# EAGLE design Versie 4 (EAGLE 7.3.0)

## Sheet 1 of 2
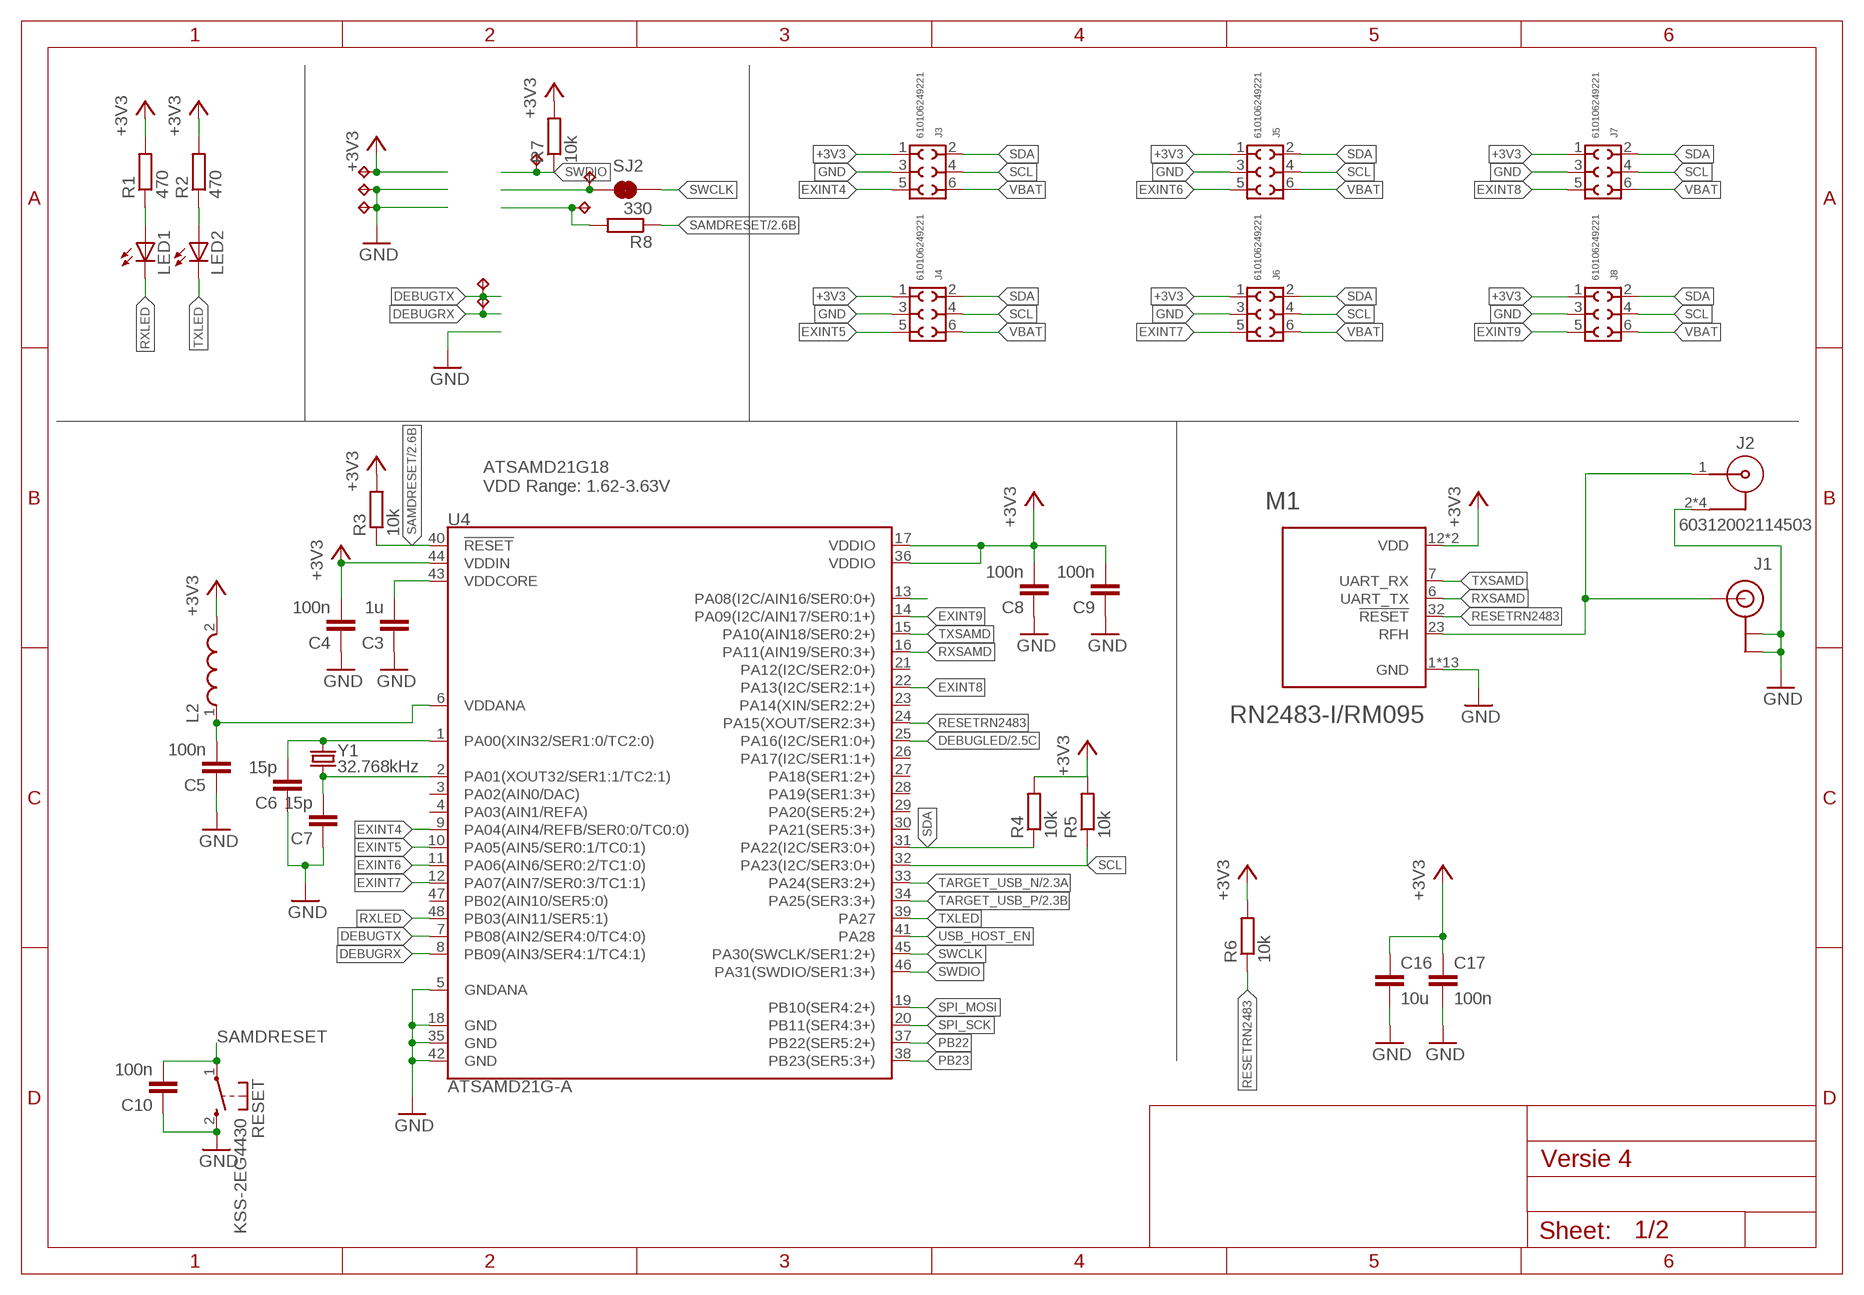
[diagram p0: schematic, sheet 1]

### Parts
C3  1u  C-EUC0603  [C0603]
C4  100n  C-EUC0603  [C0603]
C5  100n  C-EUC0603  [C0603]
C6  15p  C-EUC0603  [C0603]
C7  15p  C-EUC0603  [C0603]
C8  100n  C-EUC0603  [C0603]
C9  100n  C-EUC0603  [C0603]
C10  100n  C-EUC0603  [C0603]
C16  10u  C-EUC0805  [C0805]
C17  100n  C-EUC0603  [C0603]
J1  U.FL  [U.FL]
J2  60312002114503  [60312002114503]
J3  610106249221  6101XX249221_610106249221  [610106249221]
J4  610106249221  6101XX249221_610106249221  [610106249221]
J5  610106249221  6101XX249221_610106249221  [610106249221]
J6  610106249221  6101XX249221_610106249221  [610106249221]
J7  610106249221  6101XX249221_610106249221  [610106249221]
J8  610106249221  6101XX249221_610106249221  [610106249221]
L2  WE-CBA_0603(WB/HS)  [WE-CBA_0603(W=2.2)]
LED1  LEDCHIP-LED0603  [CHIP-LED0603]
LED2  LEDCHIP-LED0603  [CHIP-LED0603]
M1  RN2483-I/RM095  [MICROCHIP_RN2483-I/RM095]
R1  470  R-EU_R0603  [R0603]
R2  470  R-EU_R0603  [R0603]
R3  10k  R-EU_R0603  [R0603]
R4  10k  R-EU_R0603  [R0603]
R5  10k  R-EU_R0603  [R0603]
R6  10k  R-EU_R0603  [R0603]
R7  10k  R-EU_R0603  [R0603]
R8  330  R-EU_R0603  [R0603]
RESET  KSS-2EG4430  [KSS-2EG4430]
SJ2  JUMPER-PAD-2-NC_BY_TRACENO_SILK  [PAD-JUMPER-2-NC_BY_TRACE_NO_SILK]
TP1  TPB1,27  [B1,27]
TP2  TPB1,27  [B1,27]
TP3  TPB1,27  [B1,27]
TP4  TPB1,27  [B1,27]
TP5  TPB1,27  [B1,27]
TP6  TPB1,27  [B1,27]
TP7  TPB1,27  [B1,27]
TP8  TPB1,27  [B1,27]
U4  ATSAMD21G-A  [TQFP-48]
Y1  32.768kHz  CRYSTAL3.2X1.5MM  [CRYSTAL-SMD-3.2X1.5MM]

### Nets
+3V3: C4.2 C8.2 C9.2 C16.1 C17.1 J3.1 J4.1 J5.1 J6.1 J7.1 J8.1 L2.2 M1.12(VDD) M1.34(VDD) R1.2 R2.2 R3.2 R4.2 R5.2 R6.2 R7.2 TP1.TP U4.17(VDDIO) U4.36(VDDIO) U4.44(VDDIN) ; also sheet 2
BUTTON: U4.13(PA08(I2C/AIN16/SER0:0+)) ; also sheet 2
DEBUGLED: U4.25(PA16(I2C/SER1:0+)) ; also sheet 2
DEBUGRX: TP8.TP U4.8(PB09(AIN3/SER4:1/TC4:1))
DEBUGTX: TP7.TP U4.7(PB08(AIN2/SER4:0/TC4:0))
EXINT4: J3.5 U4.9(PA04(AIN4/REFB/SER0:0/TC0:0))
EXINT5: J4.5 U4.10(PA05(AIN5/SER0:1/TC0:1))
EXINT6: J5.5 U4.11(PA06(AIN6/SER0:2/TC1:0))
EXINT7: J6.5 U4.12(PA07(AIN7/SER0:3/TC1:1))
EXINT8: J7.5 U4.22(PA13(I2C/SER2:1+))
EXINT9: J8.5 U4.14(PA09(I2C/AIN17/SER0:1+))
GND: C3.1 C4.1 C5.1 C6.1 C7.1 C8.1 C9.1 C10.1 C16.2 C17.2 J1.P$1(GND) J1.P$2(GND) J2.2 J2.3 J2.4 J2.5 J3.3 J4.3 J5.3 J6.3 J7.3 J8.3 M1.1(GND) M1.8(GND) M1.11(GND) M1.20(GND) M1.21(GND) M1.22(GND) M1.24(GND) M1.26(GND) M1.27(GND) M1.28(GND) M1.33(GND) M1.41(GND) M1.47(GND) RESET.2(S) TP2.TP TP3.TP U4.5(GNDANA) U4.18(GND) U4.35(GND) U4.42(GND) ; also sheet 2
N$1: LED1.A R1.1
N$2: LED2.A R2.1
N$3: SJ2.2 TP5.TP
N$5: C6.2 U4.1(PA00(XIN32/SER1:0/TC2:0)) Y1.P$2
N$6: C7.2 U4.2(PA01(XOUT32/SER1:1/TC2:1)) Y1.P$1
N$7: C5.2 L2.1 U4.6(VDDANA)
N$10: J1.P$3(SIGNAL) J2.1 M1.23(RFH)
N$15: R8.2 TP6.TP
PB22: U4.37(PB22(SER5:2+))
PB23: U4.38(PB23(SER5:3+))
RESETRN2483: M1.32(!RESET) R6.1 U4.24(PA15(XOUT/SER2:3+))
RXLED: LED1.C U4.48(PB03(AIN11/SER5:1))
RXSAMD: M1.6(UART_TX) U4.16(PA11(AIN19/SER0:3+))
SAMDRESET: C10.2 R3.1 R8.1 RESET.1(P) U4.40(!RESET!) ; also sheet 2
SCL: J3.4 J4.4 J5.4 J6.4 J7.4 J8.4 R5.1 U4.32(PA23(I2C/SER3:0+))
SDA: J3.2 J4.2 J5.2 J6.2 J7.2 J8.2 R4.1 U4.31(PA22(I2C/SER3:0+))
SPI_MOSI: U4.19(PB10(SER4:2+))
SPI_SCK: U4.20(PB11(SER4:3+))
SWCLK: SJ2.1 U4.45(PA30(SWCLK/SER1:2+))
SWDIO: R7.1 TP4.TP U4.46(PA31(SWDIO/SER1:3+))
TARGET_USB_N: U4.33(PA24(SER3:2+)) ; also sheet 2
TARGET_USB_P: U4.34(PA25(SER3:3+)) ; also sheet 2
TXLED: LED2.C U4.39(PA27)
TXSAMD: M1.7(UART_RX) U4.15(PA10(AIN18/SER0:2+))
USB_HOST_EN: U4.41(PA28)
VBAT: J3.6 J4.6 J5.6 J6.6 J7.6 J8.6 ; also sheet 2
VDDCORE: C3.2 U4.43(VDDCORE)
Unconnected: U4.3(PA02(AIN0/DAC)) U4.4(PA03(AIN1/REFA)) U4.21(PA12(I2C/SER2:0+)) U4.23(PA14(XIN/SER2:2+)) U4.26(PA17(I2C/SER1:1+)) U4.27(PA18(SER1:2+)) U4.28(PA19(SER1:3+)) U4.29(PA20(SER5:2+)) U4.30(PA21(SER5:3+)) U4.47(PB02(AIN10/SER5:0))

### Notes on the sheet
- ATSAMD21G18
  VDD Range: 1.62-3.63V

## Sheet 2 of 2
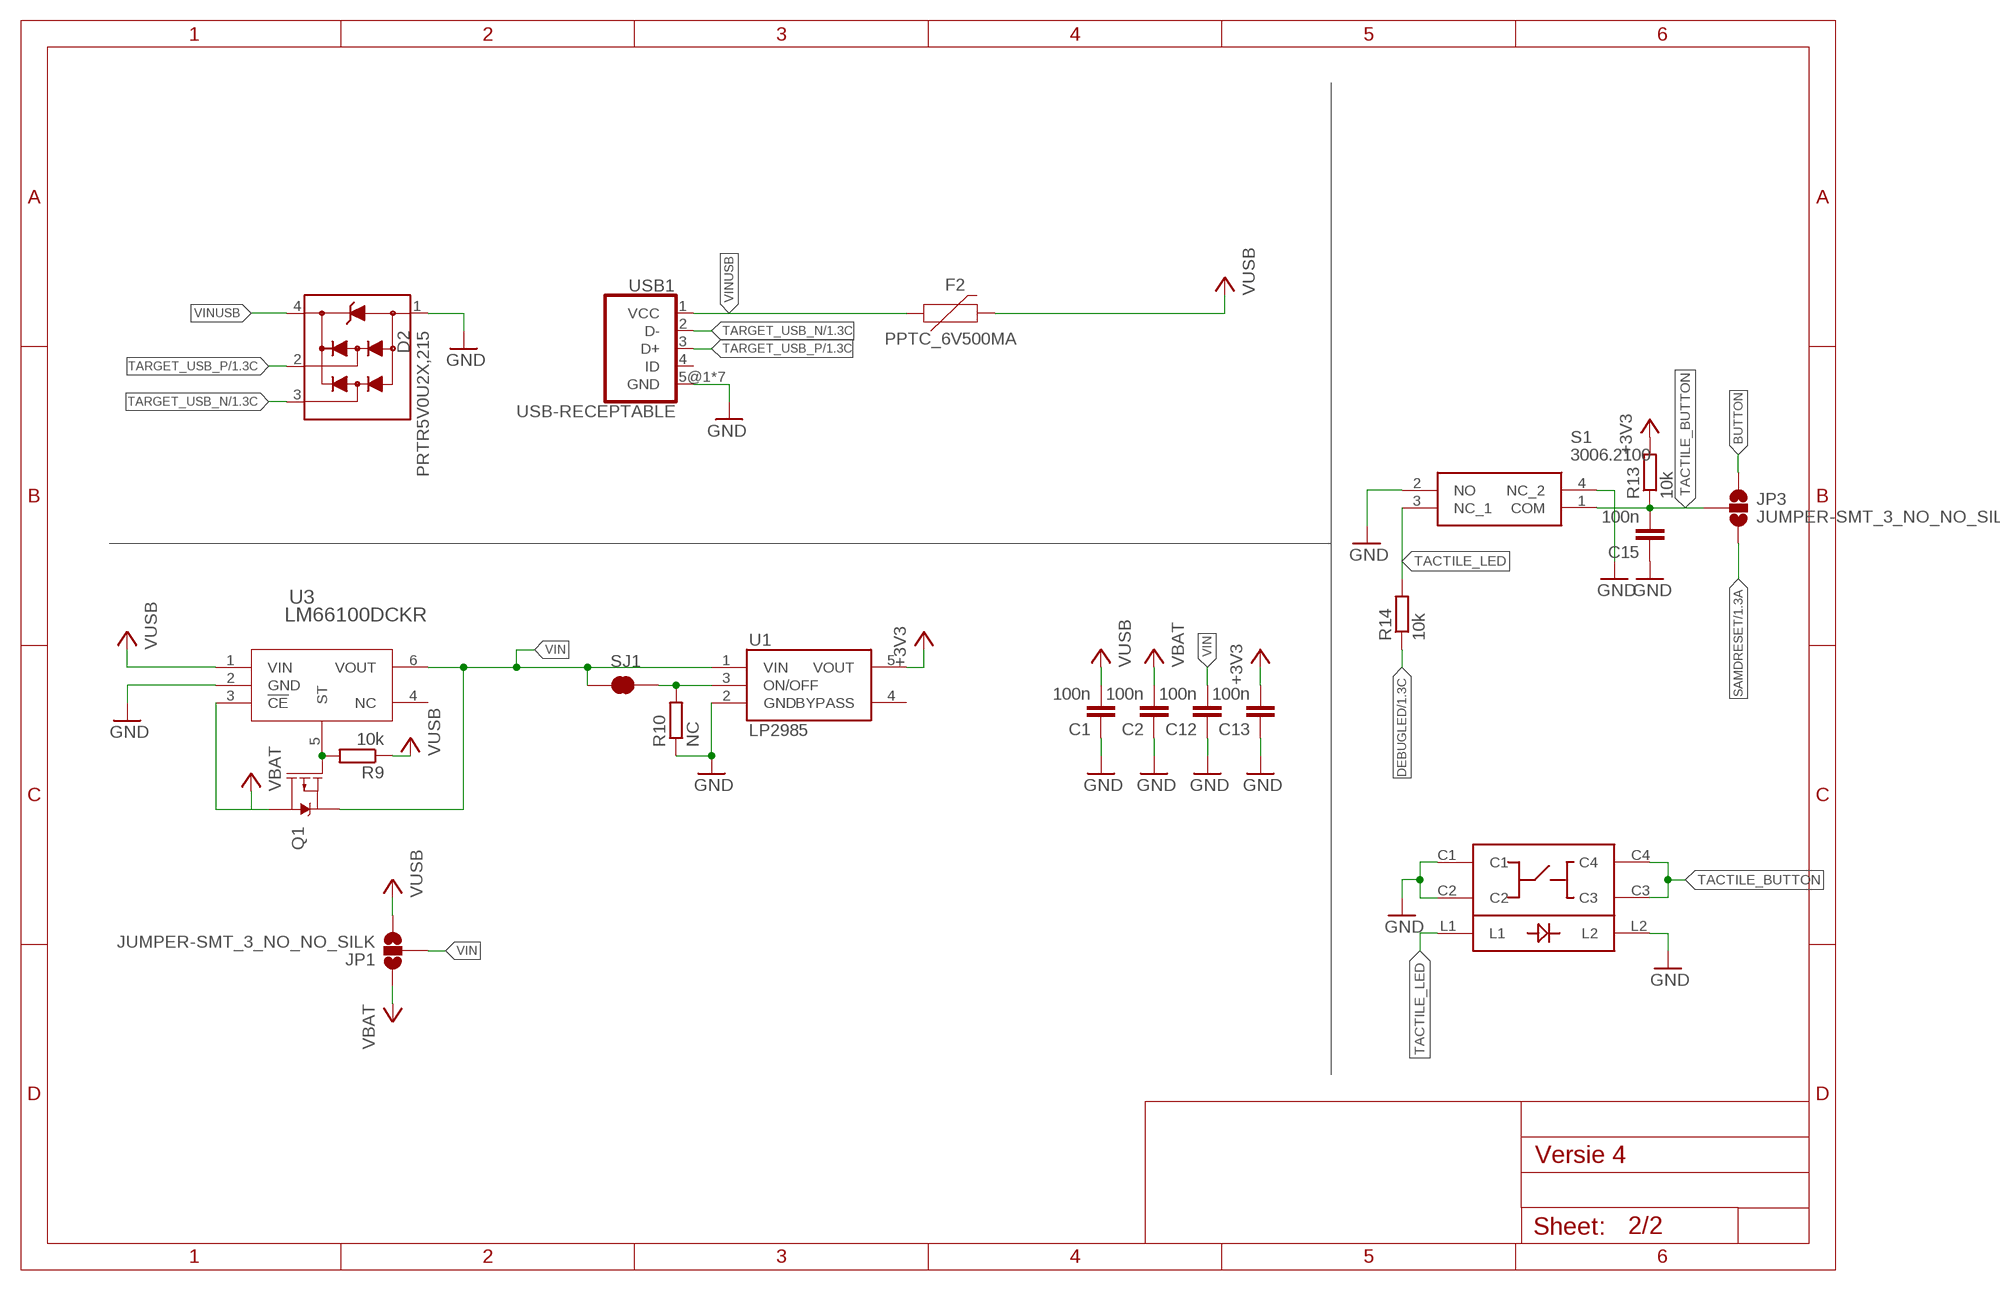
[diagram p1: schematic, sheet 2]

### Parts
C1  100n  C-EUC0603  [C0603]
C2  100n  C-EUC0603  [C0603]
C12  100n  C-EUC0603  [C0603]
C13  100n  C-EUC0603  [C0603]
C15  100n  C-EUC0603  [C0603]
D2  PRTR5V0U2X,215  [SOT143B]
F2  PPTC_6V500MA  [0805]
JP1  JUMPER-SMT_3_NO_NO_SILK  [SMT-JUMPER_3_0-NO_TRACE_NO-SILK]
JP3  JUMPER-SMT_3_NO_NO_SILK  [SMT-JUMPER_3_0-NO_TRACE_NO-SILK]
Q1  MOSFET_PCH-DMG2307L  [SOT23-3]
R9  10k  R-EU_R0603  [R0603]
R10  NC  R-EU_R0603  [R0603]
R13  10k  R-EU_R0603  [R0603]
R14  10k  R-EU_R0603  [R0603]
S1  3006.2100  [30062101]
SJ1  JUMPER-PAD-2-NC_BY_TRACENO_SILK  [PAD-JUMPER-2-NC_BY_TRACE_NO_SILK]
U1  LP2985AIM5-3.3  [SOT25]
U3  LM66100DCKR  [DCK6_TEX]
U$1  LS1201  [LS1201]
USB1  USB-RECEPTABLE  [FCI-10103594-0001LF]

### Nets
+3V3: C13.2 R13.2 U1.5(VOUT) ; also sheet 1
BUTTON: JP3.1 ; also sheet 1
DEBUGLED: R14.1 ; also sheet 1
GND: C1.1 C2.1 C12.1 C13.1 C15.1 D2.1 R10.1 S1.2(NO) S1.4(NC_2) U1.2(GND) U3.2(GND) U$1.C1 U$1.C2 U$1.L2 USB1.5@1(GND) USB1.5@2(GND) USB1.5@3(GND) USB1.5@4(GND) USB1.5@5(GND) USB1.5@6(GND) USB1.5@7(GND) ; also sheet 1
N$14: Q1.1(G) R9.2 U3.5(ST)
ONOFF: R10.2 SJ1.1 U1.3(ON/OFF)
SAMDRESET: JP3.3 ; also sheet 1
TACTILE_BUTTON: C15.2 JP3.2 R13.1 S1.1(COM) U$1.C3 U$1.C4
TACTILE_LED: R14.2 S1.3(NC_1) U$1.L1
TARGET_USB_N: D2.3 USB1.2(D-) ; also sheet 1
TARGET_USB_P: D2.2 USB1.3(D+) ; also sheet 1
VBAT: C2.2 JP1.1 Q1.3(D) U3.3(!CE) ; also sheet 1
VIN: C12.2 JP1.2 Q1.2(S) SJ1.2 U1.1(VIN) U3.6(VOUT)
VINUSB: D2.4 F2.1 USB1.1(VCC)
VUSB: C1.2 F2.2 JP1.3 R9.1 U3.1(VIN)
Unconnected: U1.4(BYPASS) U3.4(NC) USB1.4(ID)

## Library data of the parts
C1-C10 C12 C13 C15-C17 = rcl:C-EU: CAPACITOR, European symbol
D2 = PRTR5V0U2X_215:PRTR5V0U2X,215: Ultra low capacitance double rail-to-rail ESD protection diode Check prices <https://pricing.snapeda.com/parts/PRTR5V0U2X%2C215/Nexperia%20USA%20Inc./view-part?ref=eda>; AVAILABILITY: Good; DESCRIPTION: Clamp Ipp Tvs Diode Surface Mount SOT-143B; MF: Nexperia USA Inc.; MP: PRTR5V0U2X,215; PACKAGE: None; PRICE: None; PURCHASE-URL: https://pricing.snapeda.com/search/part/PRTR5V0U2X,215/?ref=eda
F2 = SparkFun-Fuses:PPTC: Resettable Fuse PPTC Resettable Fuse. Really a sort of resistor with a polymeric positive temperature coefficient whose resistance increases dramatically with an increase in temperature. When heated by the power passing through the resistance rises causing the current to be limited, protecting the circuit. This is achieved by the transition of the polymer from a crystalline to an amorphous state where the conductive carbon separates breaking the conductive pathways found in the cool crystalline structure. When a PPTC cools back down it resumes conducting letting the circuit turn back on. SparkFun Products: SparkFun RedBoard - Programmed with Arduino <https://www.sparkfun.com/products/12757> Pro Micro - 5V/16MHz <https://www.sparkfun.com/products/12640> Arduino Pro 328 - 5V/16MHz <https://www.sparkfun.com/products/10915> MP3 Trigger <https://www.sparkfun.com/products/13720>
J1 = SparkFun-Connectors:U.FL: SMD antenna connector- WRL-09144; PROD_ID: CONN-09193
J2 = Eagle_WR-SMA (rev21a):60312002114503: WR-SMA PCB THT Jack Straight MATERIAL PROPERTIES Insulator Material PTFE Insulator Color White Center Contact Material Beryllium Copper Center Contact Plating Gold, min. 0.76µm over Nickel Body Material Brass Body Plating Gold, min. 0.076µm over Nickel KIND PROPERTIES Interface MIL-STD-348 Connector Type SMA Gender Jack Orientation Type Straight GENERAL INFORMATION Operating Temperature -65 °C up to +165 °C Compliance RoHS ELECTRICAL PROPERTIES: Frequency Range DC~18 GHz MECHANICAL PROPERTIES: Mating Cycle 500 Cycles PACKAGING PROPERTIES Packaging Tray <https://katalog.we-online.com/media/images/v2/o122837v209%20WR-SMA_60312002114503.jpg> Details see: https://katalog.we-online.com/en/em/WR-SMA_THT_60312002114503 Updated by Ella Wu 2019-11-04 2019(C) Würth Elektronik; DATASHEET-URL: https://www.we-online.com/catalog/datasheet/60312002114503.pdf; GENDER: Jack; INTERFACE: MIL-STD-348; MOUNT: THT; ORIENTATION-TYPE: Straight; PART-NUMBER: 60312002114503; Z: 50Ohm
J3-J8 = WR-PHD_Rev21a:6101XX249221_610106249221: WR-PHD 2.54 mm PCB Socket Header - SMT Type - Double Row - Right Angle ARTICLE PROPERTIES: Pins:6;​ 8;​ 10;​ 12;​ 14;​ 16;​ 20;​ 22;​ 24;​ 26 KIND PROPERTIES: Pitch：2.54 mm Quality Class:3 as per CECC 75 301-802 Rows：Dual Gender：Socket Header Type：Angled MATERIAL PROPERTIES: Insulator Material :PA6T Insulator Flammability Rating:UL94 V-0 Contact Material:Copper Alloy Contact Plating:Gold Contact Type:Stamped GENERAL INFORMATION Operating Temperature:-40 up to +105 °C Compliance:Lead free / RoHS ELECTRICAL PROPERTIES: Rated Current:3 A IR 1:3 A Withstanding Voltage:600 V (AC) Contact Resistance:20 mΩ RISO:1000 MΩ CERTIFICATION UL Approval:E323964 PACKAGING PROPERTIES Packaging:Tape and Reel <https://katalog.we-online.com/media/images/v2/o33204v209%20Family_WR-PHD_6101_xx249221.jpg> Details see: https://katalog.we-online.com/en/em/PHD_2_54_SMT_DOUBLE_ROW_RIGHT_ANGLE_PCB_SOCKET_HEADER_6101XX249221 Updated by Yingchun,Shan 2019-10-24 2019 (C) Würth Elektronik; DATASHEET-URL: https://www.we-online.com/catalog/datasheet/610106249221.pdf; GENDER: Socket Header; IR: 3A; MOUNT: SMT; PACKAGING: Tape and Reel; PART-NUMBER: 610106249221; PINS: 6; PITCH: 2.54mm; ROWS: Dual; TYPE: Angled
JP1 JP3 = SparkFun-Jumpers:JUMPER-SMT_3_NO: Normally open jumper This jumper has three pads in close proximity to each other. Apply solder to close the connection(s).
L2 = EagleLibrary_Wuerth_Elektronik_eiSos_rev16a:WE-CBA: WE-CBA SMD EMI Suppression Ferrite Bead Characteristics Reliable Ni-Sn electrodes High rated current up to 5A Recommended soldering: Reflow Operating temperature: -55°C to +125°C Applications * Perfect as data line filter and for uncoupling of distribution voltage *This special SMD chip bead ferrites can be put directly on the printed circuit board. They offer excellent anti-EMI properties and low DC-resistance. Placed very close next to the interference source even with smallest size 0402,maximal impedance at 1000 Ω can be reached. *High Speed: "High Speed " SMD ferrites WE-CBF have lower impedance in the lower frequency ranges thus they have only a low attenuation for fast signals. Application e.g. USB 2.0, IEEE 1394,LVDS *Wide Band: "Wide Band" SMD ferrites WE-CBF already show high impedance in low frequency range. Therefore they are wide band through the whole spectrum. Application e.g. control signats, RS232, RS422, DC/DC converter *High Current: "High Current " SMD ferrites WE-CBF are designed for high current (over 1 A). The rated current refers to 40K self-heating. High current SMD ferrites are available in all there types (High Speed, Wide Band and High Frequency). Application e.g. power supply, DC/DC converter *Advice: Pay attention for the use of SMD-Ferrites for high current>1A and ambient temperature over +85°C that the rated current has to be reduced when temperature is above +85°C (Derating). *At+100°C environment temperature the maximal rated current has to add up to only 60% of the data sheet value ,without an overload of the component. Variant abbreviation WB means WIDE BAND HS means HIGH SPEED HC means HIGH CURRENT <http://katalog.we-online.de/media/images/eisos/FeCBA_pf2.jpg> Details see: http://katalog.we-online.de/en/pbs/WE-CBA/ Created: 2015-02-02 2015 (C) Wurth Elektronik
LED1 LED2 = led:LED: LED OSRAM: - CHIPLED LG R971, LG N971, LY N971, LG Q971, LY Q971, LO R971, LY R971 LH N974, LH R974 LS Q976, LO Q976, LY Q976 LO Q996 - Hyper CHIPLED LW Q18S LB Q993, LB Q99A, LB R99A - SideLED LS A670, LO A670, LY A670, LG A670, LP A670 LB A673, LV A673, LT A673, LW A673 LH A674 LY A675 LS A676, LA A676, LO A676, LY A676, LW A676 LS A679, LY A679, LG A679 - Hyper Micro SIDELED® LS Y876, LA Y876, LO Y876, LY Y876 LT Y87S - SmartLED LW L88C, LW L88S LB L89C, LB L89S, LG L890 LS L89K, LO L89K, LY L89K LS L896, LA L896, LO L896, LY L896 - TOPLED LS T670, LO T670, LY T670, LG T670, LP T670 LSG T670, LSP T670, LSY T670, LOP T670, LYG T670 LG T671, LOG T671, LSG T671 LB T673, LV T673, LT T673, LW T673 LH T674 LS T676, LA T676, LO T676, LY T676, LB T676, LH T676, LSB T676, LW T676 LB T67C, LV T67C, LT T67C, LS T67K, LO T67K, LY T67K, LW E67C LS E67B, LA E67B, LO E67B, LY E67B, LB E67C, LV E67C, LT E67C LW T67C LS T679, LY T679, LG T679 LS T770, LO T770, LY T770, LG T770, LP T770 LB T773, LV T773, LT T773, LW T773 LH T774 LS E675, LA E675, LY E675, LS T675 LS T776, LA T776, LO T776, LY T776, LB T776 LHGB T686 LT T68C, LB T68C - Hyper Mini TOPLED® LB M676 - Mini TOPLED Santana® LG M470 LS M47K, LO M47K, LY M47K Source: http://www.osram.convergy.de LUXEON: - LUMILED® LXK2-PW12-R00, LXK2-PW12-S00, LXK2-PW14-U00, LXK2-PW14-V00 LXK2-PM12-R00, LXK2-PM12-S00, LXK2-PM14-U00 LXK2-PE12-Q00, LXK2-PE12-R00, LXK2-PE12-S00, LXK2-PE14-T00, LXK2-PE14-U00 LXK2-PB12-K00, LXK2-PB12-L00, LXK2-PB12-M00, LXK2-PB14-N00, LXK2-PB14-P00, LXK2-PB14-Q00 LXK2-PR12-L00, LXK2-PR12-M00, LXK2-PR14-Q00, LXK2-PR14-R00 LXK2-PD12-Q00, LXK2-PD12-R00, LXK2-PD12-S00 LXK2-PH12-R00, LXK2-PH12-S00 LXK2-PL12-P00, LXK2-PL12-Q00, LXK2-PL12-R00 Source: www.luxeon.com KINGBRIGHT: KA-3528ASYC Source: www.kingbright.com
M1 = RN2483-I_RM095:RN2483-I/RM095: Sub-GHz Dual Band Long Range Transceiver LoRa Module Check prices <https://pricing.snapeda.com/parts/RN2483-I/RM095/Microchip%20Technology/view-part?ref=eda>; AVAILABILITY: Not in stock; DESCRIPTION: Sub-GHz Modules Dual Band Long Range LoRa Module; MF: Microchip Technology; MP: RN2483-I/RM095; PACKAGE: None; PRICE: None
Q1 = SparkFun-DiscreteSemi:MOSFET_PCH: P-channel MOSFETs Voltage controlled devices that allow control of high current outputs. SparkFun Products: SparkFun ESP32 Thing <https://www.sparkfun.com/products/13907> SparkFun ESP8266 Thing <https://www.sparkfun.com/products/13231>; PROD_ID: TRANS-11308; VALUE: 2.5A/30V/105mΩ
R1-R10 R13 R14 = rcl:R-EU_: RESISTOR, European symbol
RESET = buttons:KSS-2EG4430: Size: 3x6mm Height: 5mm from PCB Rating: DC12v 50mA Travel: 0.25±0.10mm Operating Force: 180±50gf Return Force: 60gf min Contact resistance: 100m? max Insulation resistance: 100M? min Operating life?50,000 cycles
S1 = SamacSys_Parts:3006.2100: Tactile Switches TACTILE Source: Datasheet <http://www.mouser.cn/datasheet/2/467/Marquardt_007102018_Specifcation3006_Series-1379934.pdf>; DESCRIPTION: Tactile Switches TACTILE; HEIGHT: 4.15mm; MANUFACTURER_NAME: MARQUARDT; MANUFACTURER_PART_NUMBER: 3006.2100; MOUSER_PART_NUMBER: 979-3006.2100
SJ1 SJ2 = SparkFun-Passives:JUMPER-PAD-2-NC_BY_TRACE
TP1-TP8 = testpad:TP: Test pad
U1 = LP2985:LP2985: LP2985-N Micropower 150 mA Low-Noise Ultra Low-Dropout Regulator
U3 = LM66100:LM66100DCKR; BUILT_BY: EMA_Jessica; COPYRIGHT: Copyright (C) 2018 Accelerated Designs. All rights reserved; MANUFACTURER_PART_NUMBER: LM66100DCKR; SOURCELIBRARY: TI_2019-12-20; VENDOR: Texas Instruments
U4 = samd21-temp:ATSAMD21G: Atmel SAMD21G SMART ARM-Based Microcontroller The Atmel ® | SMART ™ SAM D21 is a series of low-power microcontrollers using the 32-bit ARM ® Cortex ® -M0+ processor, and ranging from 32- to 64-pins with up to 256KB Flash and 32KB of SRAM. The SAM D21 devices operate at a maximum frequency of 48MHz and reach 2.46 CoreMark/MHz. They are designed for simple and intuitive migration with identical peripheral modules, hex compatible code, identical linear address map and pin compatible migration paths between all devices in the product series. All devices include intelligent and flexible peripherals, Atmel Event System for inter-peripheral signaling, and support for capacitive touch button, slider and wheel user interfaces.; PROD_ID: IC-13064
U$1 = button:LS1201
USB1 = daspilker:USB-RECEPTABLE: USB Receptable
Y1 = samd21-temp:CRYSTAL: Various standard crystals. Proven footprints.; PROD_ID: XTAL-13062

## Board
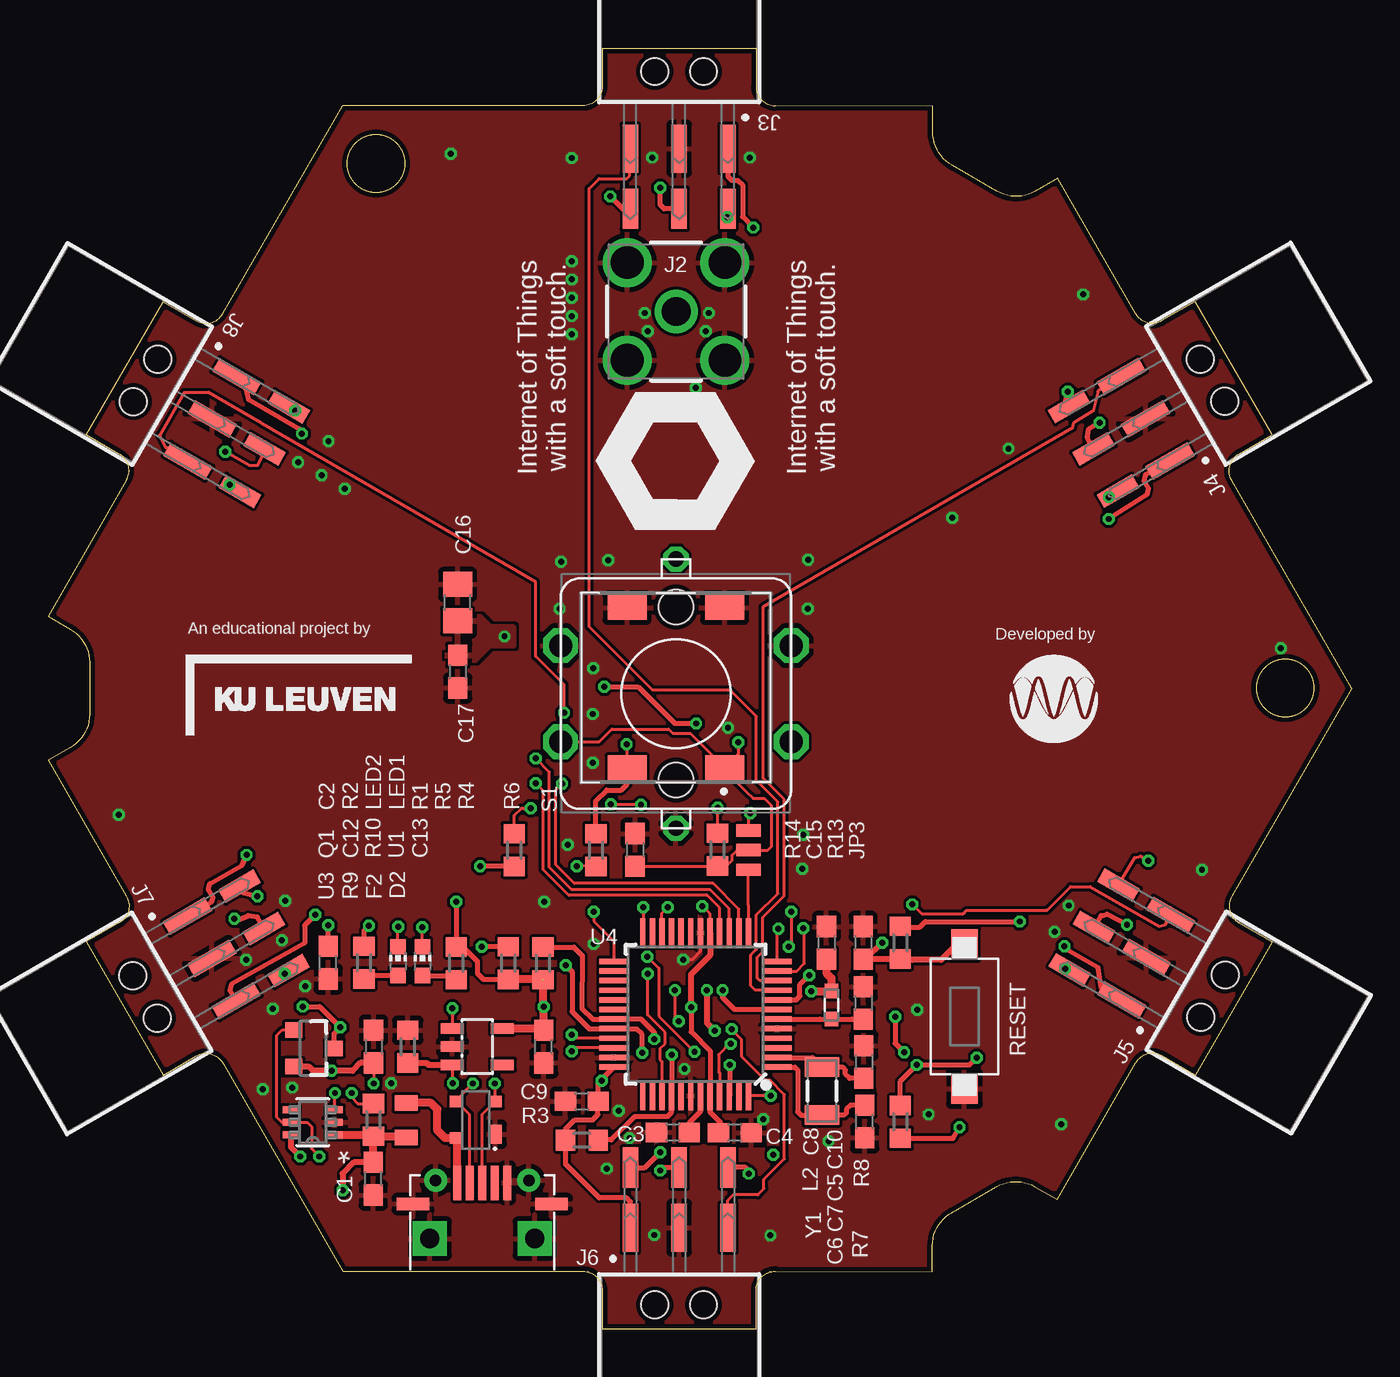
[diagram p2: board, top side]
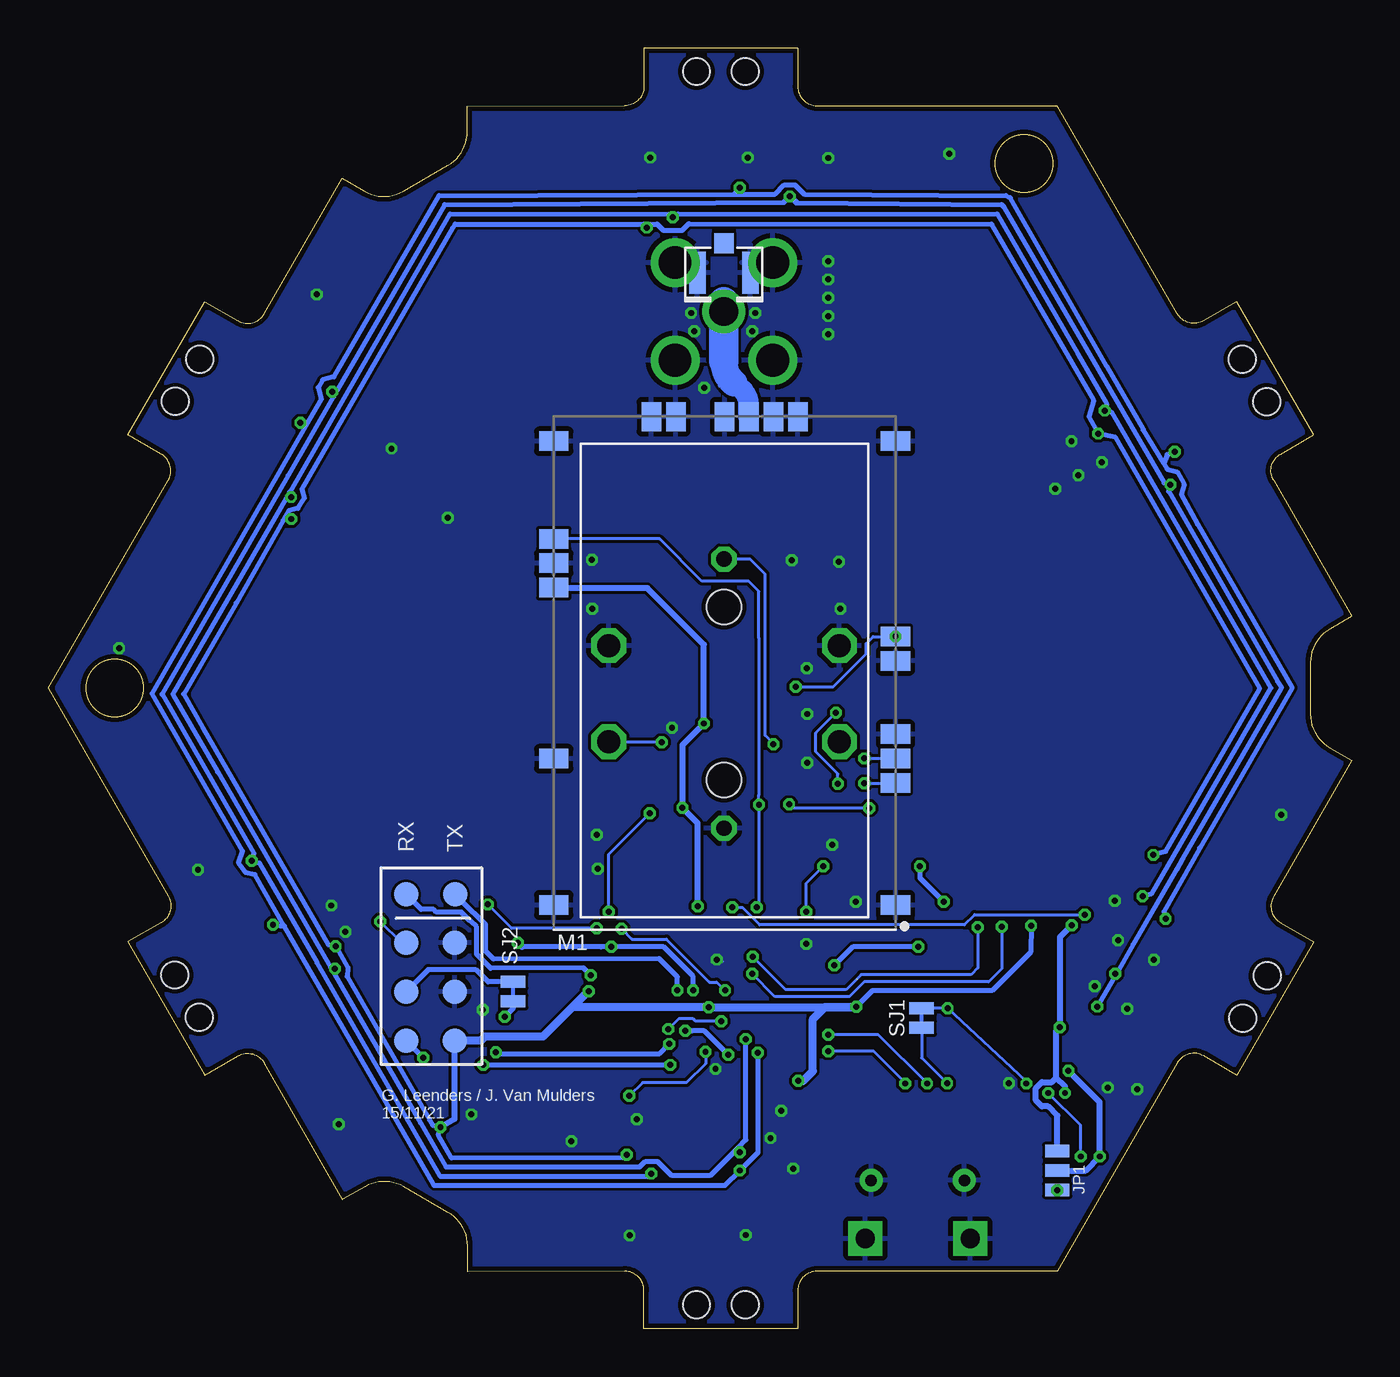
[diagram p3: board, bottom side, seen from below]

Size 67.83 x 66.63 mm. Coordinates in mm from the lower left corner, seen from the top.
Outline: 15.33,3 27.83,3 arc-90 28.83,2 28.83,0 36.83,0 36.83,2 arc-90 37.83,3 46.01,2.98
Outline: 15.33,3.01 9.08,13.84 arc90 7.71,14.2 5.98,13.2 1.98,20.13 3.71,21.13 arc90 4.08,22.5 0,29.57 1.16,30.24 arc60 2.16,31.97 2.16,34.67 arc60 1.16,36.4 0,37.07 4.08,44.15 arc90 3.71,45.51 1.98,46.51 5.98,53.44 7.71,52.44 arc90 9.08,52.8 15.33,63.63 27.83,63.63 arc90 28.83,64.63 28.83,66.63 36.83,66.63 36.83,64.63 arc90 37.83,63.63 46.02,63.6
Outline: 52.52,59.85 51.36,59.18 arc-60 49.36,59.18 47.03,60.53 arc-60 46.03,62.26 46.02,63.6
Outline: 46,2.98 46.01,4.32 arc-60 47.01,6.05 49.34,7.4 arc-60 51.34,7.4 52.5,6.73
Outline: 52.5,6.72 56.58,13.84 arc-90 57.95,14.2 59.68,13.2 63.68,20.13 61.95,21.13 arc-90 61.58,22.5 67.83,33.32 61.58,44.15 arc-90 61.95,45.51 63.68,46.51 59.68,53.44 57.95,52.44 arc-90 56.58,52.8 52.52,59.85
Outline: circle at 64.36,33.33 radius 1.5
Outline: circle at 17.06,60.63 radius 1.5
Copper layers (1*16): Top 0.035mm / dielectric 1.5mm / Bottom 0.035mm
Design rules "SeeedStudio_2layer_DRU_no_angle_20140221": minimum track width 6mil, minimum drill 12mil, track to track 6mil, track to pad 6mil, pad to pad 6mil, via to via 6mil, smd to smd 0mil, copper to edge 10mil, drill to drill 10mil, minimum pad ring 10mil, minimum via ring 6mil, stop-mask expansion 2mil, vias tented up to drill 100mil, thermal gap 10mil

### Footprints (pad centres in the part's own frame; a part is rotated, then mirrored left to right if it is on the bottom)
C0603 = smd 1.1 x 1: 1 -0.85,0; 2 0.85,0
C0805 = smd 1.3 x 1.5: 1 -0.95,0; 2 0.95,0
SOT143B = smd 1 x 0.7: 1 -0.75,-1 | smd 0.6 x 0.7: 2 0.95,-1; 3 0.95,1; 4 -0.95,1
0805 = smd 0.8 x 1.2: 1 -0.9,0; 2 0.9,0
U.FL = smd 2.2 x 0.85: P$1 0,1.375; P$2 0,-1.375 | smd 1.05 x 1: P$3 1.525,0; P$4 -1.525,0
60312002114503 = drill 1.5: 1 0,0 | drill 1.7: 2 -2.54,2.54; 3 2.54,2.54; 4 2.54,-2.54; 5 -2.54,-2.54
610106249221 = smd 0.8 x 2.5: 1 -2.54,6.76; 3 0,6.76; 5 2.54,6.76 | smd 0.8 x 2.1: 2 -2.54,9.89; 4 0,9.89; 6 2.54,9.89 | hole 1.4: -1.27,2.75; 1.27,2.75
SMT-JUMPER_3_0-NO_TRACE_NO-SILK = smd 0.635 x 1.27: 1 -1.016,0; 2 0,0; 3 1.016,0
WE-CBA_0603(W=2.2) = smd 0.75 x 0.7: 1 -0.725,0; 2 0.725,0
CHIP-LED0603 = smd 0.8 x 0.8: A 0,-0.75; C 0,0.75
MICROCHIP_RN2483-I/RM095 = smd 1.524 x 1.016: 1 -8.89,12.065; 6 -8.89,5.715; 7 -8.89,4.445; 8 -8.89,3.175; 11 -8.89,-0.635; 12 -8.89,-1.905; 20 -8.89,-12.065; 28 8.89,-12.065; 32 8.89,-6.985; 33 8.89,-5.715; 34 8.89,-4.445; 41 8.89,4.445; 47 8.89,12.065 | smd 1.016 x 1.524: 21 -3.81,-13.335; 22 -2.54,-13.335; 23 -1.27,-13.335; 24 0,-13.335; 26 2.54,-13.335; 27 3.81,-13.335
SOT23-3 = smd 0.8 x 0.9: 1 -0.95,-1; 2 0.95,-1; 3 0,1.1
R0603 = smd 1 x 1.1: 1 -0.85,0; 2 0.85,0
KSS-2EG4430 = smd 1.6 x 1.4: 1 -3.75,0; 2 3.75,0
30062101 = smd 2.025 x 1.275: 1 2.537,-4.162; 2 -2.538,4.162; 3 -2.538,-4.162; 4 2.537,4.162
PAD-JUMPER-2-NC_BY_TRACE_NO_SILK = smd 0.635 x 1.27: 1 -0.508,0; 2 0.508,0
B1,27 = smd 1.27 x 1.27: TP 0,0
SOT25 = smd 0.55 x 1.2: 1 -0.95,-1.3; 2 0,-1.3; 3 0.95,-1.3; 4 0.95,1.3; 5 -0.95,1.3
DCK6_TEX = smd 0.851 x 0.356: 1 -1.137,0.65; 2 -1.137,0; 3 -1.137,-0.65; 4 1.137,-0.65; 5 1.137,0; 6 1.137,0.65
TQFP-48 = smd 1.5 x 0.28: 1 -4.25,2.75; 2 -4.25,2.25; 3 -4.25,1.75; 4 -4.25,1.25; 5 -4.25,0.75; 6 -4.25,0.25; 7 -4.25,-0.25; 8 -4.25,-0.75; 9 -4.25,-1.25; 10 -4.25,-1.75; 11 -4.25,-2.25; 12 -4.25,-2.75; 25 4.25,-2.75; 26 4.25,-2.25; 27 4.25,-1.75; 28 4.25,-1.25; 29 4.25,-0.75; 30 4.25,-0.25; 31 4.25,0.25; 32 4.25,0.75; 33 4.25,1.25; 34 4.25,1.75; 35 4.25,2.25; 36 4.25,2.75 | smd 0.28 x 1.5: 13 -2.75,-4.25; 14 -2.25,-4.25; 15 -1.75,-4.25; 16 -1.25,-4.25; 17 -0.75,-4.25; 18 -0.25,-4.25; 19 0.25,-4.25; 20 0.75,-4.25; 21 1.25,-4.25; 22 1.75,-4.25; 23 2.25,-4.25; 24 2.75,-4.25; 37 2.75,4.25; 38 2.25,4.25; 39 1.75,4.25; 40 1.25,4.25; 41 0.75,4.25; 42 0.25,4.25; 43 -0.25,4.25; 44 -0.75,4.25; 45 -1.25,4.25; 46 -1.75,4.25; 47 -2.25,4.25; 48 -2.75,4.25
LS1201 = drill 1.2 octagon: C1 0,5; C2 12,5; C3 0,0; C4 12,0 | drill 0.8 octagon: L1 6,9.5; L2 6,-4.5 | hole 1.8: 6,-2; 6,7
FCI-10103594-0001LF = smd 0.4 x 1.8: 1 -1.3,4.6; 2 -0.65,4.6; 3 0,4.6; 4 0.65,4.6; 5@1 1.3,4.6 | drill 0.6 pad 1.2: 5@2 -2.425,4.73; 5@3 2.425,4.73 | drill 1 pad 1.778 square: 5@4 -2.725,1.7; 5@5 2.725,1.7 | smd 1.7 x 0.635: 5@6 -3.6,3.5; 5@7 3.6,3.5
CRYSTAL-SMD-3.2X1.5MM = smd 1 x 1.8: P$1 -1.25,0; P$2 1.25,0

### Placement (x,y rotation side)
C1  16.92,7.81 90 top
C2  14.57,19.05 90 top
C3  32.5,10.22 0 top
C4  35.73,10.21 180 top
C5  42.41,16.96 270 top
C6  42.49,10.78 90 top
C7  42.44,13.88 270 top
C8  40.49,20.08 270 top
C9  27.77,11.84 0 top
C10  42.4,20.08 270 top
C12  16.93,14.68 270 top
C13  25.79,14.68 90 top
C15  30.54,24.92 270 top
C16  21.31,37.78 90 top
C17  21.31,34.19 270 top
D2  22.25,10.87 90 top
F2  18.62,10.85 270 top
J1  32.67,54.95 270 bottom
J2  32.67,52.93 0 top
J3  32.83,68.16 180 top
J4  62.95,50.73 120 top
J5  62.98,15.94 60 top
J6  32.83,-1.5 0 top
J7  2.67,15.89 300 top
J8  2.69,50.71 240 top
JP1  15.33,8.24 270 bottom
JP3  36.44,24.91 90 top
L2  40.75,16.84 90 top
LED1  19.47,19.13 0 top
LED2  18.2,19.13 0 top
M1  32.63,34.11 180 bottom
Q1  13.78,14.59 270 top
R1  21.24,19.01 90 top
R2  16.44,19.05 90 top
R3  27.77,9.82 180 top
R4  25.75,19.01 270 top
R5  23.94,19.03 270 top
R6  24.25,24.91 270 top
R7  44.34,10.77 270 top
R8  44.34,20.09 90 top
R9  16.93,10.87 90 top
R10  18.71,14.68 270 top
R13  34.83,24.93 90 top
R14  28.5,24.91 90 top
RESET  47.67,16.25 270 top
S1  32.66,33.36 0 top
SJ1  22.38,16.17 90 bottom
SJ2  43.63,17.54 90 bottom
TP1  46.66,15 0 bottom
TP2  46.66,17.54 0 bottom
TP3  46.66,20.08 0 bottom
TP4  49.2,15 0 bottom
TP5  49.2,17.54 0 bottom
TP6  49.2,20.08 0 bottom
TP7  46.66,22.6 0 bottom
TP8  49.2,22.6 0 bottom
U1  22.33,14.68 270 top
U3  13.77,10.75 180 top
U4  33.68,16.37 180 top
U$1  26.66,30.55 0 top
USB1  22.59,3 0 top
Y1  40.26,12.37 270 top

### Tracks (layer width: path | path; a pad name or v marks a point on that pad's centre or on a via)
+3V3  (via drill 0.31)  (1 unrouted)
  Top 0.152: R13.2 v34.83,27.1 | U4.17 34.41,20.64 34.41,21.61 v34.03,21.99 | 10.19,49.3 J8.1
  Top 0.254: 34.9,10.23 C4.2 34.98,9.83 34.98,10.74 34.44,11.29 U4.44 34.45,12.13 34.45,14.46 33.46,15.45 v33.46,16.73 | 28.62,12.8 C9.2 28.61,11.83 28.61,11.14 28.34,10.87 27.41,10.87 26.92,10.38 R3.2 26.92,8.56 28.66,6.81 30.09,6.81 30.29,6.61 J6.1 | 28.62,12.8 U4.36 | 28.62,12.8 28.7,12.8 v28.81,12.9 | 34.45,20.6 U4.17 | R5.2 22.65,18.18 22.33,18.49 22.33,19.13 21.59,19.86 R1.2 21.23,19.87 v21.23,22.21 | R2.2 16.44,20.72 v16.69,20.97 | R7.2 47.03,9.92 47.07,9.91 v47.41,10.48 47.41,10.49 | 10.19,49.3 10.42,48.35 13.15,46.78 v13.21,46.58 | v28.94,33.4 30.7,33.4 32.59,31.5 v33.7,31.5 v33.71,31.49 | R6.2 22.48,24.06 v22.47,24.07 | J3.1 35.37,59.95 35.57,59.75 35.89,59.75 36.13,59.52 36.13,57.85 v36.68,57.29 | J4.1 57.08,44.43 57,44.12 57.24,43.72 57.16,43.4 v55.18,42.13 | J5.1 54.78,17.76 54.7,18.24 54.62,18.8 52.95,19.75 v52.87,19.91 | J7.1 8.5,22.21 8.58,22.45 8.34,22.84 8.42,23.16 10.09,24.11 v10.33,24.66
  Top 0.305: 34.45,20.6 34.45,19.43 33.46,18.44 v33.46,16.73 | 21.3,36.91 C16.1
  Top 0.406: U1.5 25.69,15.63 C13.2 v25.79,16.75 25.77,16.77 25.77,18.14 R4.2 | 25.76,18.19 R5.2 | v39.7,17.57 L2.2 40.75,18.25 40.49,18.51 C8.2
  Bottom 0.152: v28.94,33.4 26.99,33.4 25.27,35.12 25.27,35.65 24.91,36.01 23.76,36.01 M1.12 | 41.55,38.54 41.52,38.54 M1.34
  Bottom 0.254: 55.61,42.06 55.3,42.56 54.83,42.68 54.5,43.22 54.62,43.68 46.79,57.28 46.67,57.47 36.84,57.47 | 55.61,42.06 58.05,37.75 60.78,33.02 59.77,31.26 53.25,19.98 v52.87,19.91 52.24,18.8 52.28,18.33 47.98,10.86 47.83,10.6 v47.41,10.48 47.53,10.07 46.85,8.89 37.86,8.92 v37.72,9.06 | v16.69,20.97 16.72,19.6 18.72,17.59 24.95,17.59 v25.79,16.75 | 46.7,14.99 TP1.TP 46.68,14.98 | v10.33,24.66 9.7,24.82 9.69,24.84 4.81,33.31 4.8,33.31 12.3,46.37 v13.21,46.58 13.68,47.46 13.44,48.3 18.73,57.45 18.75,57.47 34.47,57.48 34.51,57.48 34.85,57.13 35.81,57.13 36.15,57.47 36.84,57.47 | v22.47,24.07 22.47,23.46 v21.23,22.21 | v36.68,57.29 36.84,57.47 | v55.18,42.13 55.61,42.06
  Bottom 0.305: 41.55,38.54 36.65,38.54 33.71,35.6 v33.71,31.49 34.82,30.38 v34.82,27.11 v34.83,27.1 34.03,26.31 v34.03,21.99 | 46.7,14.99 46.69,10.92 v47.41,10.48
  Bottom 0.406: v28.81,12.9 28.56,12.9 28.05,13.41 28.05,16.12 27.41,16.75 v25.79,16.75 25.81,16.73 v33.46,16.73 40.56,16.73 | v39.7,17.57 39.72,17.57 40.56,16.73 | 40.56,16.73 41.73,15.55 | 46.66,15.03 TP1.TP 45.31,14.99 45.11,15.2 42.09,15.2 41.73,15.55 | 41.73,15.55
  other vias: 23.74,36.02
  pour Top: 22.35,37.16 20.76,37.16 20.76,34.62 22.03,34.62 22.99,35.57 23.45,35.57 24.22,35.54 24.22,36.5 22.97,36.52 22.99,36.52
BUTTON
  Top 0.152: U4.13 36.42,22.06 36.42,23.87 JP3.1
DEBUGLED  (via drill 0.31)
  Top 0.152: R14.1 28.4,24.08 v27.51,24.06 | v28.4,21.7 28.4,21.22 29.44,20.18 U4.25
  Bottom 0.152: v28.4,21.7 28.4,23.17 v27.51,24.06
DEBUGRX  (via drill 0.31)
  Top 0.254: U4.8 38.92,17.12 39.11,17.31 39.11,17.92 v39.6,18.4
  Bottom 0.254: v39.6,18.4 39.98,18.78 44.8,18.75 45.54,19.49 45.54,20.91 45.84,21.22 45.9,21.24 46.33,21.68 47.62,21.68 47.78,21.83 48.42,21.83 TP8.TP
DEBUGTX  (via drill 0.31)
  Top 0.254: U4.7 35.7,16.62 35.09,17.23 v35.09,17.62
  Bottom 0.254: TP7.TP 46.66,22.59 45.74,21.68 45.69,21.65 45.08,21.04 45.08,19.67 44.65,19.24 36.04,19.26 35.09,18.31 v35.09,17.62
EXINT4
  Top 0.152: U4.9 36.78,17.62 36.56,17.84 36.56,19.45 36.85,19.74 36.85,21.53 37.97,22.65 37.97,27.42 36.85,28.54 36.85,31.86 35.49,33.23 31.45,33.23 28.15,36.53 28.15,58.07 28.15,59.31 28.66,59.83 30.09,59.83 30.25,59.99 30.25,61.36 J3.5
EXINT5
  Top 0.152: U4.10 37.03,18.12 36.91,18.25 36.91,19.34 37.18,19.62 37.18,21.4 38.3,22.52 38.3,27.55 37.2,28.64 37.21,37.56 37.2,37.56 53.3,46.87 53.35,47.13 54.38,47.77 54.62,48.8 J4.5
EXINT6  (via drill 0.31)
  Top 0.152: U4.11 38.95,18.62 39.34,19.01 39.34,20.79 v39.29,20.84 | v44.96,22.08 45.44,21.6 47.6,21.6 47.78,21.78 51.93,21.78 51.95,21.78 51.97,21.78 53.19,23 54.22,23 57.8,20.94 58.11,21.02 J5.5
  Bottom 0.152: v39.29,20.84 43.71,20.84 v44.96,22.08
EXINT7  (via drill 0.31)
  Top 0.152: U4.12 37.94,20.7 v38,20.81 | v32.61,17.62 32.61,16.21 v32.81,16.01 | v35.56,15.6 35.56,15.57 36.07,15.06 36.07,14.17 37.29,12.95 37.55,12.95 38.31,12.19 38.31,8.84 37.24,7.77 37.24,7.29 36.92,6.97 35.65,6.97 35.37,6.69 J6.5
  Bottom 0.152: v38,20.81 37.46,20.28 35.66,20.28 33.42,18.04 33.04,18.04 v32.61,17.62 | v32.81,16.01 34.15,16.01 34.27,16.13 35.03,16.13 v35.56,15.6
EXINT8  (via drill 0.31)
  Top 0.152: U4.22 31.94,21.63 v32.23,21.93
  Top 0.254: v13.91,21.55 13.35,20.99 13.35,20.07 9.54,17.92 9.46,17.61 J7.5
  Bottom 0.152: v32.23,21.93 31.72,21.93 30.81,21.01 20.17,21.01 19.63,21.55 v13.91,21.55
EXINT9  (via drill 0.31)
  Top 0.152: U4.14 35.94,21.83 34.59,23.17 27.38,23.17 26.41,24.14 26.41,28.04 v26.74,28.36 | v26.84,32.04 26.84,33.52 25.37,34.99 25.37,38.77 25.36,38.87 11.11,47.11 8.34,48.72 7.07,48.72 5.8,46.5 6.12,45.86 J8.5
  Bottom 0.152: v26.74,28.36 26.74,28.87 27.88,30.01 27.88,31 v26.84,32.04
GND  (via drill 0.31)
  Top 0.152: U4.18 33.94,19.64 33.5,19.21 v33.04,19.21
  Bottom 0.152: v33.04,19.21 32.85,19.21 32.75,19.11
  other vias: 3.67,26.75 20.96,61.13 12.7,12.56 17.84,12.78 11.18,12.47 64.14,35.42 52.71,10.65 33.11,13.52 37.2,10.9 29.06,8.34 28.38,20.03 25.8,22.22 27.04,25.19 28.34,29.45 35.37,31.27 39.23,23.94 53.86,53.81 49.96,45.8 33.69,48.97 31.05,52.85 40.6,9.76 37.58,4.86 31.53,4.88 12.33,22.27 13.38,17.82 10.3,19.2 11.7,16.66 14.59,46.17 13.01,45.08 14.23,44.4 15.44,43.7 27.24,55.55 27.24,54.59 27.24,53.64 27.24,52.69 27.24,51.74 27.24,60.91 31.43,60.94 36.51,60.94 52.36,20.66 53.09,22.02 60.03,23.88 45.81,11.16 45.22,16.6 12.17,20.22 28.34,31.99 28.36,34.37 26.61,37.47 29.15,39.98 26.69,39.91 39.51,37.47 39.54,40.01 47.03,42.19 39.28,25.71 29.69,11.36 30.25,9.93 31.2,51.9 34.22,51.9 34.38,52.85
  pour Top (rank 6): 93.21,49.11 21.72,90.39 -24,11.2 47.49,-30.07
  pour Bottom (rank 6): 34.29,-22.45 -24,11.2 21.72,90.39 93.21,49.11 47.49,-30.07
N$1
  Top 0.254: LED1.A 21.02,18.38 R1.1
N$2
  Top 0.254: LED2.A 16.61,18.38 R2.1
N$3
  Bottom 0.254: 48.05,18.7 48.05,18.69 | 48.05,18.69 TP5.TP | 48.05,18.69 48.04,18.68 45.57,18.68 44.94,18.05 SJ2.2
N$5
  Top 0.254: C6.2 41.75,11.63 41.53,11.42 41.53,11.24 41.41,11.12 Y1.P$2 39.17,11.12 38.99,11.29 38.99,13.48 38.85,13.62 U4.1
N$6
  Top 0.254: U4.2 39.77,14.12 Y1.P$1 40.28,13.6 41.36,13.6 41.48,13.48 41.48,13.25 41.7,13.03 C7.2
N$7
  Top 0.254: U4.6 40.16,16.12 L2.1 41.81,16.12 C5.2
N$10  (1 unrouted)
  Bottom 0.254: J1.P$3 J2.1
  Bottom 1.067: 31.4,47.47 31.4,48.28 arc-50 32.16,49.2 | 32.67,50.34
  Bottom 1.397: 32.16,49.2 arc50 32.67,50.34
  Bottom 1.524: 32.67,50.34 J2.1
  Bottom 1.54: 32.67,53.34 J1.P$3
N$14  (via drill 0.31)
  Top 0.152: Q1.1 12.77,15.56 12.18,15.56 11.9,15.28 11.9,11 12.16,10.75 U3.5 13.48,10.75 13.71,10.52 13.71,9.38 v14.11,8.97 | R9.2 16.12,11.71 15.79,12.04 v15.79,12.27
  Bottom 0.152: v14.11,8.97 14.11,10.59 v15.79,12.27
N$15  (via drill 0.31)
  Top 0.254: R8.2 44.59,20.89 45.34,20.89 45.64,21.19 v50.54,21.19
  Bottom 0.152: TP6.TP 49.43,20.08 v50.54,21.19
  Bottom 0.254: v50.54,21.19 50.63,21.19
ONOFF  (via drill 0.31)
  Top 0.152: v21.06,12.78 21.06,13.7 U1.3
  Top 0.305: R10.2 19.69,13.83 19.79,13.73 U1.3
  Bottom 0.152: SJ1.1 22.38,14.1 v21.06,12.78
RESETRN2483  (via drill 0.31)
  Top 0.152: v30.96,21.93 30.96,20.64 U4.24 | R6.1 24.25,26.71 24.63,27.09 v25.12,27.09 | v29.28,27.29 30.82,27.29 v30.85,27.27
  Bottom 0.152: v30.96,21.93 30.85,22.04 v30.85,27.27 30.85,27.78 30.85,35.94 30.85,38.36 31.39,38.9 33.81,38.9 36.01,41.1 M1.32 | v25.12,27.09 29.08,27.09 v29.28,27.29
RXLED  (via drill 0.31)
  Top 0.152: LED1.C 19.47,20.88 v19.46,20.89 | U4.48 36.44,12.12 v37.59,12.12 | 31.18,19.36 v31.17,19.36 31.18,19.36 | 31.18,19.36 31.77,18.77 31.77,16.27 v33.63,14.41
  Bottom 0.152: v19.46,20.89 19.46,18.79 19.82,18.43 25.53,18.43 26.32,17.64 29.46,17.64 v31.17,19.36 | v33.63,14.41 33.63,13.8 34.62,12.81 36.91,12.81 v37.59,12.12
RXSAMD  (via drill 0.31)
  Top 0.152: U4.16 34.94,21.91 34.29,22.55 27.09,22.55 25.75,23.89 25.75,28 v25.37,28.38
  Bottom 0.152: v25.37,28.38 23.82,28.38 23.82,28.4 M1.6
SAMDRESET  (via drill 0.31)
  Top 0.152: v36.53,26.82 v36.52,26.83 36.44,26.75 JP3.3 | v38.66,21.7 38.66,20 v38.53,19.87
  Top 0.254: v32.44,14.26 U4.40 32.44,11.27 32.22,11.05 30.52,11.05 29.3,9.83 R3.1
  Top 0.305: RESET.1 47.67,20.33 47.6,20.41 47.6,20.34 46.46,19.2 44.97,19.2 44.96,19.21 R8.1 42.55,19.24 v43.39,20.08 | v34.28,17.62 34.28,15.92 v34.69,15.51
  Top 0.406: C10.2 42.41,19.24 42.55,19.24
  Bottom 0.152: v38.66,21.7 38.66,24.7 v36.52,26.83
  Bottom 0.254: v32.44,14.26 33.69,15.51 34.33,15.51 v34.69,15.51 | 43.16,19.87 39.06,19.87 v38.53,19.87 35.81,19.87 34.28,18.34 v34.28,17.62
  Bottom 0.305: 43.16,19.87 v43.39,20.08
SCL  (via drill 0.31)
  Top 0.152: J8.4 11.2,45.55 10.88,44.91 10.49,44.91 v9.22,45.62
  Top 0.254: R5.1 v22.56,19.88 | v26.93,18.91 27.26,18.58 27.26,16.5 28.15,15.61 U4.32 | U4.32 | U4.32 30.61,15.61 30.9,15.32 v30.9,14.37 | J6.4 31.99,8.39 v31.84,8.24 | J3.4 32.05,58.27 31.84,58.48 v31.84,59.36 | J4.4 54.06,46.34 54.14,46.81 v54.7,47.13 | J5.4 54.78,21.49 55.1,21.57 v56.13,21.02 | J7.4 10.88,21.41 10.41,21.49 9.85,21.26 v9.69,21.34
  Bottom 0.254: 9.78,45.04 9.61,44.73 9.09,44.59 8.72,43.95 8.87,43.41 8.03,41.86 8.03,41.85 3.12,33.34 7.92,25.02 9.78,21.7 v9.69,21.34 | v9.22,45.62 9.62,45.48 9.78,45.04 | 9.78,45.04 10.86,46.77 10.85,46.79 12.76,50.09 17.77,58.84 17.8,58.84 17.99,58.95 28.5,59.04 28.98,59.52 29.53,59.52 30.01,59.03 32.03,59.03 | v22.56,19.88 25.96,19.88 v26.93,18.91 | 32.03,59.03 47.5,58.95 52.96,49.52 53.55,49.37 53.78,48.97 53.62,48.37 54.42,46.98 | 32.03,59.03 32.16,59.03 v31.84,59.36 | v31.84,8.24 | v31.84,8.24 32.62,7.46 36.65,7.46 47.75,7.46 47.77,7.51 55.54,20.95 | v30.9,14.37 30.9,9.18 v31.84,8.24 | 54.42,46.98 62.43,33.05 57.72,24.86 57.92,24.25 57.58,23.77 57.07,23.64 55.54,20.95 | v54.7,47.13 54.42,46.98 | v56.13,21.02 55.54,20.95
SDA  (via drill 0.31)
  Top 0.152: J8.2 v12.86,47.77
  Top 0.254: R4.1 27.35,19.86 27.79,19.42 27.77,16.68 28.35,16.12 U4.31 30.85,16.12 31.54,15.43 v31.54,15.08 | 12.84,47.77 v12.86,47.77 | 35.23,57.69 v35.34,57.82 35.37,57.93 J3.2 | v55.19,43.27 J4.2 | 52.97,18.75 v52.91,18.73 J5.2 | J6.2 31.04,8.39 v31.84,9.19 | J7.2 10.17,22.68 v10.89,22.5
  Bottom 0.254: 61.34,33.02 55.43,43.21 v55.19,43.27 55.26,43.53 46.93,58.01 35.5,57.98 v35.34,57.82 35.23,57.82 35.06,57.99 18.48,58.01 18.44,57.98 14.26,50.72 | 61.34,33.02 | 61.34,33.02 59.01,28.98 53.13,18.79 v52.91,18.73 52.96,18.52 48.45,10.71 47.13,8.42 37.76,8.42 37.05,8.42 36.76,8.71 36.13,8.71 35.42,8 33.35,8 31.92,9.43 | 14.26,50.72 14.25,50.72 | 14.26,50.72 12.76,48.13 v12.86,47.77 12.83,47.78 12.52,47.7 4.22,33.34 4.23,33.34 10.44,22.62 v10.89,22.5 | 31.92,9.43 31.52,9.83 31.52,15.06 v31.54,15.08 | v31.84,9.19 31.92,9.43
  Bottom 0.305: v31.54,15.08
SWCLK  (via drill 0.31)
  Top 0.152: v35.51,14.82 35.44,14.82 34.88,14.26 34.88,13.38 34.93,13.32 U4.45
  Top 0.254: v44.07,16.24 44.07,14.85 v44.53,14.39
  Bottom 0.254: v35.51,14.82 36.02,14.31 44.45,14.31 v44.53,14.39 | 44.04,16.27 v44.07,16.24 43.63,16.67 SJ2.1
SWDIO  (via drill 0.31)
  Top 0.254: v35.46,13.73 35.46,12.14 U4.46 | R7.1 44.34,12.88 v45.19,13.73 47.93,13.73 v48.31,14.11
  Bottom 0.254: v45.19,13.73 v35.46,13.73 | v48.31,14.11 TP4.TP
TACTILE_BUTTON  (via drill 0.31)
  Top 0.152: C15.2 34.82,24.07 R13.1 35.3,24.08 35.58,24.37 35.58,24.65 35.84,24.91 JP3.2 | 35.18,29.18 35.18,29.09 36.3,27.97 36.68,27.59 37.26,27.59 37.62,27.24 37.62,25.08 37.45,24.91 JP3.2 | v35.91,30.52 35.91,29.91 S1.1 33.41,30.98 32.51,30.98 32.28,31.21 29.33,31.21 28.67,30.55 U$1.C3 | JP3.2
  Top 0.254: 35.18,29.18 S1.1
  Bottom 0.152: U$1.C4 35.94,30.55 v35.91,30.52
TACTILE_LED  (via drill 0.31)
  Top 0.152: S1.3 30.12,30.39 v30.09,30.42
  Top 0.254: 30.05,29.13 S1.3 30.12,28.34 29.81,28.03 29.05,28.03 28.5,27.48 R14.2
  Bottom 0.152: v30.09,30.42 30.09,30.44 30.52,30.88 30.52,39.26 31.31,40.05 U$1.L1 | U$1.L1
TARGET_USB_N  (via drill 0.31)
  Top 0.152: USB1.2 21.94,11.14 D2.3 21.25,11.92 v22.1,12.77 | U4.33 27.42,15.13 v27.25,15.31
  Bottom 0.152: v22.1,12.77 24.64,15.31 v27.25,15.31
TARGET_USB_P  (via drill 0.31)
  Top 0.152: USB1.3 22.59,11.15 D2.2 23.25,12.76 v23.25,12.77 | U4.34 27.42,14.62 v27.25,14.44
  Bottom 0.152: v27.25,14.44 24.87,14.44 23.25,12.82 v23.25,12.77
TXLED  (via drill 0.31)
  Top 0.152: LED2.C 18.2,20.91 v18.22,20.92 | U4.39 31.93,13.91 31.83,14.01 31.83,14.57 32.1,14.84 32.1,15.43 31.19,16.34 31.19,17.51 v31.2,18.47
  Bottom 0.152: v18.22,20.92 18.22,18.73 18.9,18.05 25.38,18.05 26.14,17.29 30.02,17.29 v31.2,18.47
TXSAMD  (via drill 0.31)
  Top 0.152: U4.15 35.44,21.86 34.44,22.86 27.24,22.86 26.08,24.01 26.08,28.96 v25.37,29.68
  Bottom 0.152: v25.37,29.68 23.8,29.68 23.8,29.67 M1.7
VBAT  (via drill 0.31)
  Top 0.152: U3.3 14.91,12.25 v14.93,12.27 | 14.88,14.6 Q1.3 | J8.6 v9.44,43.92 | J5.6 56.53,24.51 56.84,24.59 v57.23,24.35
  Top 0.254: C2.2 14.57,21.03 v14.58,21 | v13.24,16.77 14.13,16.77 v15.21,15.69 14.88,15.36 14.88,14.6 | v36.44,8.08 36.44,8.24 36.28,8.4 J6.6 | J3.6 29.89,58.27 v29.25,58.91 | J4.6 52.95,48.24 v53.05,48.75 | v12.31,18.48 J7.6
  Top 0.305: J7.6 12.55,18.64
  Bottom 0.152: 53.84,19.06 53.84,19.04
  Bottom 0.254: 53.84,19.06 56.84,24.25 v57.23,24.35 57.13,24.73 61.89,33.01 61.9,33.04 55.34,44.41 52.98,48.49 v53.05,48.75 52.77,48.83 47.2,58.49 29.56,58.6 v29.25,58.91 | 53.84,19.04 47.44,7.95 36.72,7.95 36.67,7.95 36.58,7.95 v36.44,8.08 | 18.17,58.46 18.12,58.39 | 18.12,58.39 9.77,44.01 v9.44,43.92 9.53,43.57 3.87,33.67 3.65,33.35 8.8,24.46 | 9.13,23.9 8.8,24.46 | 8.8,24.46 11.11,20.46 11.38,20 12.24,18.51 | 12.24,18.51 v13.24,16.77 v13.25,16.77 | v29.25,58.91 28.91,58.57 28.84,58.57 | 28.84,58.57 18.23,58.49 18.12,58.39 | v29.25,58.91 29.18,58.91 28.84,58.57 | 12.24,18.51 v12.31,18.48
  Bottom 0.305: v14.93,12.27 14.93,12.61 15.38,13.07 | 15.38,13.07 15.38,15.51 v15.21,15.69 15.18,15.71 15.18,20.4 v14.58,21 | 15.38,13.07 15.61,12.84 16.12,12.84 16.44,12.53 16.44,11.89 16.12,11.57 15.81,11.57 15.33,11.1 JP1.1
VDDCORE
  Top 0.254: U4.43 33.94,11.3 33.35,10.72 C3.2
VIN  (via drill 0.31)
  Top 0.152: 12.8,13.63 Q1.2 | C12.2 v16.93,12.77 | v21.04,16.68 U1.1
  Top 0.305: 12.8,13.63 13.58,13.63 13.78,13.43 v14.75,13.43 15.84,13.43 16.25,13.83 C12.2 | U3.6 12.63,9.46 v13.12,8.97
  Bottom 0.152: v16.93,12.77 16.93,12.89 v21.04,16.68 SJ1.2
  Bottom 0.305: v14.75,13.43 13.12,11.8 v13.12,8.97 13.85,8.24 JP1.2
VINUSB
  Top 0.406: USB1.1 21.29,9.89 D2.4 20.65,9.92 20.25,10.33 20.25,11.43 19.92,11.76 18.64,11.76 F2.1
VUSB  (via drill 0.31)
  Top 0.305: C1.2 15.91,8.66 15.33,8.08 v15.33,7.21
  Top 0.406: U3.1 16.86,10.1 R9.1 | R9.1 18.55,10.02 F2.2 | C1.2 R9.1
  Bottom 0.305: v15.33,7.21 JP1.3

### Text on the board
tNames: Internet of Things / with a soft touch. | Internet of Things / with a soft touch. | An educational project by | Developed by
bNames: TX | RX | G. Leenders / J. Van Mulders / 15/11/21